# Altium schematic sheet TalonSRXBreakout.SchDoc
size A
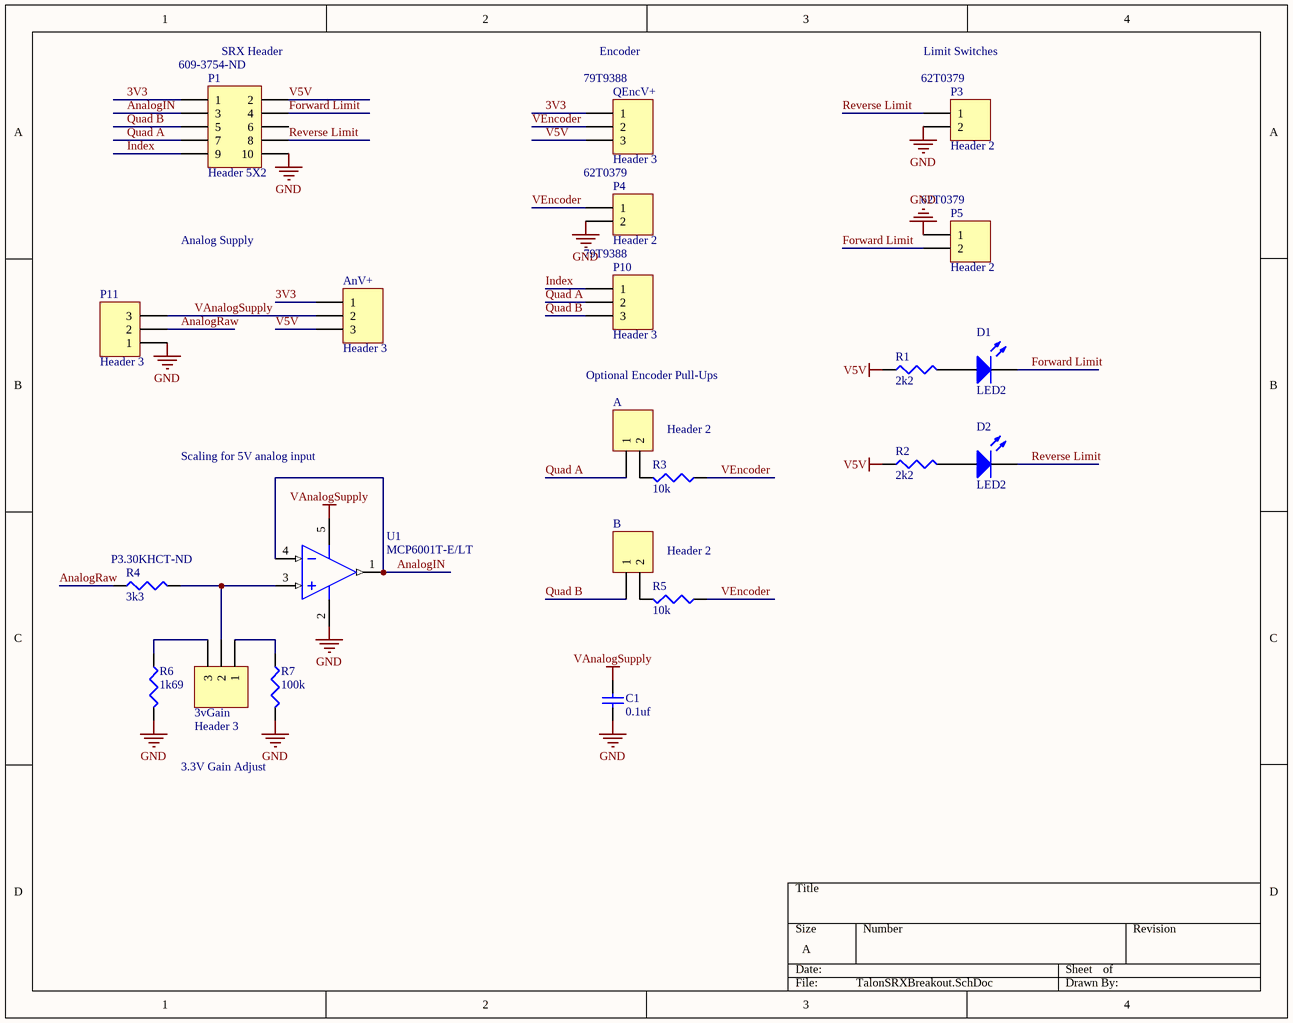
[diagram p0: TalonSRXBreakout.SchDoc]

## Parts
3vGain  Header 3  [3 Pad Jumper]
A  Header 2  [2 Pad Jumper]
AnV+  Header 3  [3 Pad Jumper]
B  Header 2  [2 Pad Jumper]
C1  0.1uf  [CAP 0603 (1608)]
D1  LED2  [DIODE 0603/SOD-523F]
D2  LED2  [DIODE 0603/SOD-523F]
P1  Header 5X2  Supplier Part Number 1: 609-3754-ND  [HDR2X5 - 50Mil]
P3  Header 2  Supplier Part Number 1: 62T0379  [Wago 2 Pin]
P4  Header 2  Supplier Part Number 1: 62T0379  [Wago 2 Pin]
P5  Header 2  Supplier Part Number 1: 62T0379  [Wago 2 Pin]
P10  Header 3  Supplier Part Number 1: 79T9388  [Wago 3 Pin]
P11  Header 3  [Wago 3 Pin]
QEncV+  Header 3  Supplier Part Number 1: 79T9388  [3 Pad Jumper]
R1  2k2  [RES 0603 (1608)]
R2  2k2  [RES 0603 (1608)]
R3  10k  [RES 0603 (1608)]
R4  Supplier Part Number 2: P3.30KHCT-ND  [RES 0603 (1608)]  (hidden comment: 3k3)
R5  10k  [RES 0603 (1608)]
R6  1k69  [RES 0603 (1608)]
R7  100k  [RES 0603 (1608)]
U1  MCP6001T-E/LT  [SC70-LT5_N]

## Nets
GND: C1.1 P1.10 P3.2 P4.2 P5.1 P11.1 R6.2 R7.2 U1.2(VSS)
V5V: AnV+.3 P1.2 QEncV+.3 R1.1 R2.1
VAnalogSupply: AnV+.2 C1.2 P11.3 U1.5(VDD)
3V3: AnV+.1 P1.1 QEncV+.1
AnalogIN: P1.3 U1.1(VOUT) U1.4(VIN-)
AnalogRaw: P11.2 R4.1
Forward Limit: D1.2(K) P1.4 P5.2
Index: P1.9 P10.1
Quad A: A.1 P1.7 P10.2
Quad B: B.1 P1.5 P10.3
Reverse Limit: D2.2(K) P1.8 P3.1
VEncoder: P4.1 QEncV+.2 R3.1 R5.1
Net3vGain_1: 3vGain.1 R7.1
Net3vGain_2: 3vGain.2 R4.2 U1.3(VIN+)
Net3vGain_3: 3vGain.3 R6.1
NetA_2: A.2 R3.2
NetB_2: B.2 R5.2
NetD1_1: D1.1(A) R1.2
NetD2_1: D2.1(A) R2.2

Not connected (* = marked no-connect by the designer): P1 6

## Notes on the sheet
- (near P1) SRX Header
- Encoder
- Limit Switches
- Analog Supply
- Optional Encoder Pull-Ups
- Scaling for 5V analog input
- 3.3V Gain Adjust

## Library data of the parts
3vGain AnV+ P10 P11 QEncV+ = Header 3: Header, 3-Pin; LatestRevisionDate: 24-Feb-2012; Publisher: Electron
  P10 QEncV+: Supplier 1: Newark
A B P3-P5 = Header 2: Header, 2-Pin
  A B: LatestRevisionDate: 24-Feb-2012; Publisher: Electron
  P3-P5: LatestRevisionDate: 17-Jul-2002; LatestRevisionNote: Re-released for DXP Platform.; Publisher: Altium Limited; Supplier 1: Newark
C1 = Capacitor Surface Mount: Supplier Part Number 1: 311-1344-1-ND; Supplier 1: Digi-Key; Value: 0.1uf
D1 D2 = LED2: Typical RED, GREEN, YELLOW, AMBER GaAs LED; Published: 8-Jun-2000; LatestRevisionDate: 17-Jul-2002; LatestRevisionNote: Re-released for DXP Platform.; PackageVersion: Feb-2002; PackageReference: 3.2X1.6X1.1; Publisher: Altium Limited; PackageDescription: SM LED; 2 Flat Leads; Supplier 1: Digi-Key; Supplier Part Number 1: 160-1646-1-ND
P1 = Header 5X2: Header, 5-Pin, Dual row; LatestRevisionDate: 17-Jul-2002; LatestRevisionNote: Re-released for DXP Platform.; Publisher: Altium Limited; Supplier 1: Digi-Key
R1-R7 = Resistor Surface Mount: Supplier 1: Digi-Key
  R1 R2: Supplier Part Number 1: P2.2KJCT-ND; Value: 2k2
  R3 R5: Supplier Part Number 1: P10KGCT-ND; Value: 10k
  R4: Supplier Part Number 1: P3.3KHCT-ND; Value: 3k3; Supplier 2: Digi-Key
  R6: Supplier Part Number 1: P1.69KHCT-ND; Value: 1k69
  R7: Supplier Part Number 1: P100KHCT-ND; Value: 100k
U1 = MCP6001T-E/LT: 1 MHz, Low-Power Operational Amplifier, 5-Pin SC-70, Extended Temperature, Tape and Reel; Published: 29-Jan-2009; LatestRevisionDate: 02-Dec-2009; LatestRevisionNote: Updated to datasheet revision J, Nov-2009; DatasheetVersion: revJ, Nov-2009; PackageVersion: revBB, Aug-2009; PackageReference: SC70-LT5; Publisher: Altium Limited; PackageDescription: 5-Lead Plastic Small Outline Transistor (LT) [SC70]; Supplier 1: Digi-Key; Supplier Part Number 1: MCP6001T-E/LTCT-ND; Supplier 2: Digi-Key; Supplier Part Number 2: MCP6001T-E/LTCT-ND; Supplier 3: Digi-Key; Supplier Part Number 3: MCP6001T-E/LTCT-ND; Code_IPC: SOT353-5; ComponentLink1Description: Datasheet; ComponentLink1URL: http://ww1.microchip.com/downloads/en/DeviceDoc/21733j.pdf; ComponentLink2Description: Packaging Specification; ComponentLink2URL: http://www.microchip.com/stellent/groups/techpub_sg/documents/packagingspec/en012702.pdf; ComponentLink3Description: Microchip.com Home; ComponentLink3URL: http://www.microchip.com/